# EAGLE design inverter_control (EAGLE 4.16)
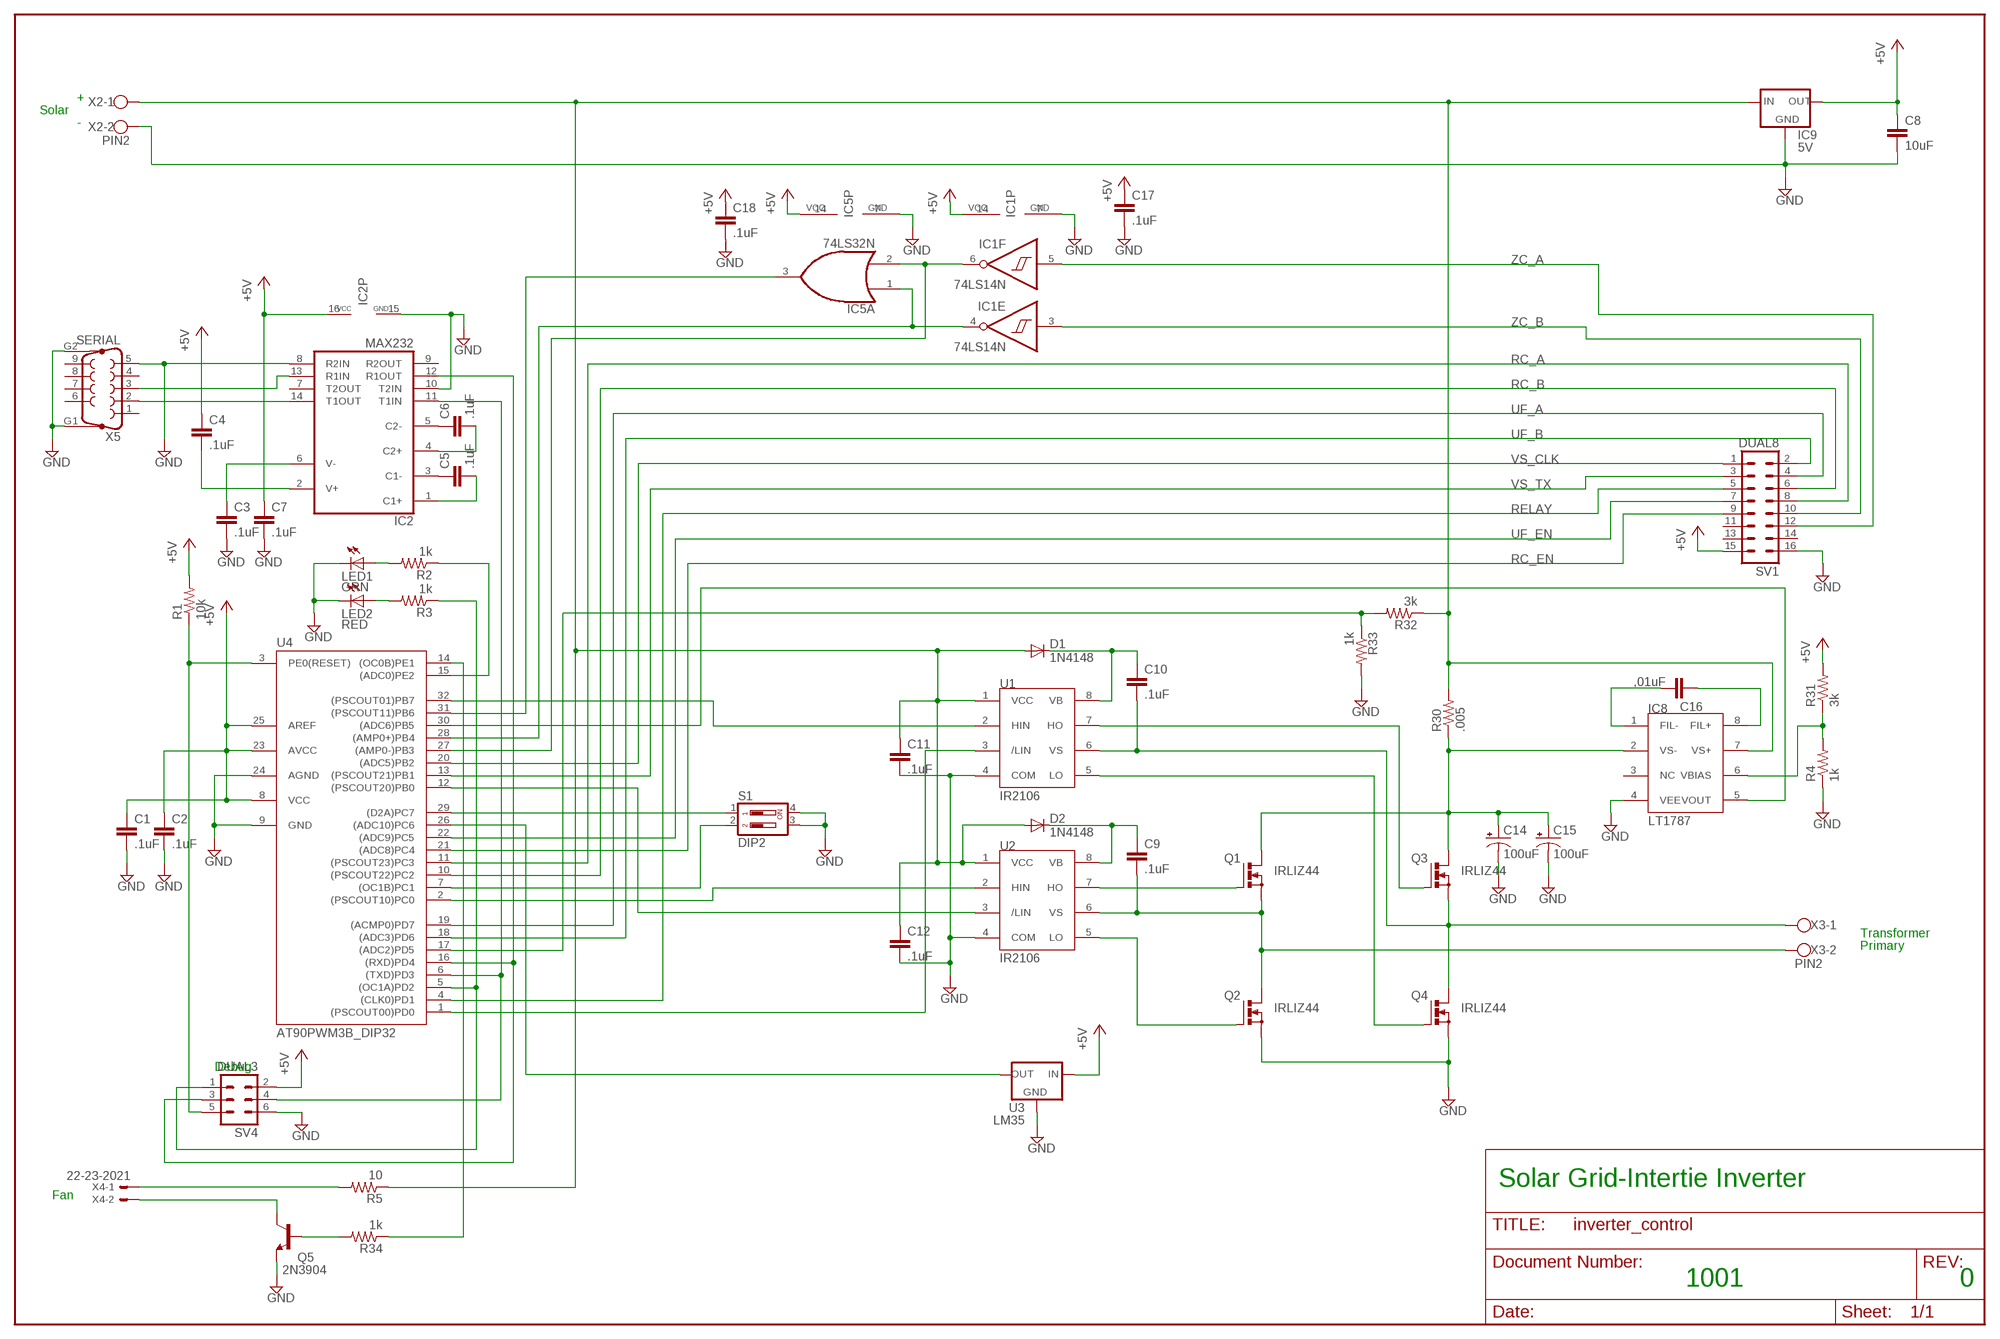
[diagram p0: schematic, sheet 1]

## Parts
C1  .1uF  C2,5-3  [C2.5-3]
C2  .1uF  C2,5-3  [C2.5-3]
C3  .1uF  C2,5-3  [C2.5-3]
C4  .1uF  C2,5-3  [C2.5-3]
C5  .1uF  C2,5-3  [C2.5-3]
C6  .1uF  C2,5-3  [C2.5-3]
C7  .1uF  C2,5-3  [C2.5-3]
C8  10uF  C5/3.5  [C5B3.5]
C9  .1uF  C2,5-3  [C2.5-3]
C10  .1uF  C2,5-3  [C2.5-3]
C11  .1uF  C2,5-3  [C2.5-3]
C12  .1uF  C2,5-3  [C2.5-3]
C14  100uF  CPOL-USE5-13  [E5-13]
C15  100uF  CPOL-USE5-13  [E5-13]
C16  ,01uF  C2,5-3  [C2.5-3]
C17  .1uF  C2,5-3  [C2.5-3]
C18  .1uF  C2,5-3  [C2.5-3]
D1  1N4148  [DO35-10]
D2  1N4148  [DO35-10]
IC1  74LS14N  [DIL14]
IC2  MAX232  [DIL16]
IC5  74LS32N  [DIL14]
IC8  LT1787  [SO08]
IC9  5V  78XXS  [78XXS]
LED1  GRN  LED3MM  [LED3MM]
LED2  RED  LED3MM  [LED3MM]
Q1  IRLIZ44  PMOSFET_NTO220BV  [TO220BV]
Q2  IRLIZ44  PMOSFET_NTO220BV  [TO220BV]
Q3  IRLIZ44  PMOSFET_NTO220BV  [TO220BV]
Q4  IRLIZ44  PMOSFET_NTO220BV  [TO220BV]
Q5  2N3904  [TO92]
R1  10k  R-US_0207/10  [0207/10]
R2  1k  R-US_0207/10  [0207/10]
R3  1k  R-US_0207/10  [0207/10]
R4  1k  R-US_0207/10  [0207/10]
R5  10  R-US_0207/10  [0207/10]
R30  .005  R-US_0207/12  [0207/12]
R31  3k  R-US_0207/10  [0207/10]
R32  3k  R-US_0207/10  [0207/10]
R33  1k  R-US_0207/10  [0207/10]
R34  1k  R-US_0207/10  [0207/10]
S1  DIP2  SD4-02  [SD4-02]
SV1  DUAL8  MA08-2  [MA08-2]
SV4  DUAL3  MA03-2  [MA03-2]
U1  IR2106  IR2103  [DIL08]
U2  IR2106  IR2103  [DIL08]
U3  LM35  [TO220S]
U4  AT90PWM3B_DIP32  [DIL32]
X2  PIN2  W237-02P  [W237-132]
X3  PIN2  W237-02P  [W237-132]
X4  22-23-2021  [22-23-2021]
X5  SERIAL  F09HP  [F09HP]

## Nets
+5V: C1.1 C2.1 C4.1 C7.1 C8.1 C17.1 C18.1 IC1.14(P:VCC) IC2.16(VCC) IC5.14(P:VCC) IC9.OUT R1.2 R31.2 SV1.15 SV4.2 U3.1(IN) U4.8(VCC) U4.23(AVCC) U4.25(AREF)
+VSOL: C11.1 C12.1 D1.A D2.A IC8.7(VS+) IC9.IN R5.1 R30.2 R32.1 U1.1(VCC) U2.1(VCC) X2.1
FIL+: C16.2 IC8.8(FIL+)
FIL-: C16.1 IC8.1(FIL-)
GND: C1.2 C2.2 C3.2 C7.2 C8.2 C11.2 C12.2 C14.- C15.- C17.2 C18.2 IC1.7(P:GND) IC2.8(R2IN) IC2.10(T2IN) IC2.15(GND) IC5.7(P:GND) IC8.4(VEE) IC9.GND LED1.K(C) LED2.K(C) Q2.S Q4.S Q5.3(E) R4.1 R33.2 S1.3 S1.4 SV1.16 SV4.6 U1.4(COM) U2.4(COM) U3.2(GND) U4.9(GND) U4.24(AGND) X2.2 X5.5 X5.G1 X5.G2
N$1: R34.1 U4.14((OC0B)PE1)
N$2: R2.1 U4.15((ADC0)PE2)
N$3: C3.1 IC2.6(V-)
N$4: C4.2 IC2.2(V+)
N$5: C6.1 IC2.5(C2-)
N$6: R1.1 SV4.5 U4.3(PE0(RESET))
N$7: C6.2 IC2.4(C2+)
N$8: R32.2 R33.1 U4.17((ADC2)PD5)
N$9: R5.2 X4.1
N$10: U1.3(/LIN) U4.1((PSCOUT00)PD0)
N$11: U1.2(HIN) U4.32((PSCOUT01)PB7)
N$12: IC2.14(T1OUT) X5.2
N$13: IC2.13(R1IN) X5.3
N$14: C5.1 IC2.3(C1-)
N$15: C5.2 IC2.1(C1+)
N$16: U3.3(OUT) U4.26((ADC10)PC6)
N$17: IC2.11(T1IN) SV4.4 U4.6((TXD)PD3)
N$18: IC2.12(R1OUT) SV4.3 U4.16((RXD)PD4)
N$19: LED1.A R2.2
N$20: LED2.A R3.2
N$21: U2.3(/LIN) U4.12((PSCOUT20)PB0)
N$23: Q5.1(C) X4.2
N$24: IC8.6(VBIAS) R4.2 R31.1
N$26: Q2.G U2.5(LO)
N$27: Q1.G U2.7(HO)
N$28: C9.2 Q1.S Q2.D U2.6(VS) X3.2
N$29: Q4.G U1.5(LO)
N$30: C10.2 Q3.S Q4.D U1.6(VS) X3.1
N$32: Q3.G U1.7(HO)
N$35: IC8.5(VOUT) U4.30((ADC6)PB5)
N$41: Q5.2(B) R34.2
N$47: R3.1 SV4.1 U4.5((OC1A)PD2)
N$51: S1.2 U4.7((OC1B)PC1)
N$54: S1.1 U4.29((D2A)PC7)
N$63: U2.2(HIN) U4.2((PSCOUT10)PC0)
N$65: IC1.6(F:O) IC5.2(A:I1) U4.27((AMP0-)PB3)
N$66: IC1.4(E:O) IC5.1(A:I0) U4.28((AMP0+)PB4)
N$67: IC5.3(A:O) U4.31((PSCOUT11)PB6)
RC_A: SV1.8 U4.11((PSCOUT23)PC3)
RC_B: SV1.6 U4.10((PSCOUT22)PC2)
RC_EN: SV1.9 U4.21((ADC8)PC4)
RELAY: SV1.5 U4.4((CLK0)PD1)
UF_A: SV1.4 U4.19((ACMP0)PD7)
UF_B: SV1.2 U4.18((ADC3)PD6)
UF_EN: SV1.7 U4.22((ADC9)PC5)
VB: C9.1 C10.1 D1.C D2.C U1.8(VB) U2.8(VB)
VBRIDGE: C14.+ C15.+ IC8.2(VS-) Q1.D Q3.D R30.1
VS_CLK: SV1.1 U4.20((ADC5)PB2)
VS_TX: SV1.3 U4.13((PSCOUT21)PB1)
ZC_A: IC1.5(F:I) SV1.12
ZC_B: IC1.3(E:I) SV1.10
Unconnected: IC1.1(D:I) IC1.2(D:O) IC1.8(C:O) IC1.9(C:I) IC1.10(B:O) IC1.11(B:I) IC1.12(A:O) IC1.13(A:I) IC2.7(T2OUT) IC2.9(R2OUT) IC5.4(B:I0) IC5.5(B:I1) IC5.6(B:O) IC5.8(C:O) IC5.9(C:I0) IC5.10(C:I1) IC5.11(D:O) IC5.12(D:I0) IC5.13(D:I1) IC8.3(NC) SV1.11 SV1.13 SV1.14 X5.1 X5.4 X5.6 X5.7 X5.8 X5.9

## Notes on the sheet
- +
- Solar
- -
- Transformer
- Primary
- Debug
- Solar Grid-Intertie Inverter
- Fan
- 1001 | 0

## Library data of the parts
C1-C12 C16-C18 = capacitor-wima:C: CAPACITOR naming: grid - package width
C14 C15 = rcl:CPOL-US: POLARIZED CAPACITOR, American symbol
D1 D2 = diode:1N4148: DIODE high speed (Philips)
IC1 = 74xx-us:74*14: Hex schmitt trigger INVERTER
IC2 = maxim:MAX232: RS232 TRANSEIVER
IC5 = 74xx-us:74*32: Quad 2-input OR gate
IC8 = SolarFlasher:LT1787
IC9 = v-reg:78XXS: VOLTAGE REGULATOR
LED1 LED2 = led:LED: LED OSRAM: - CHIPLED LG R971, LG N971, LY N971, LG Q971, LY Q971, LO R971, LY R971 LH N974, LH R974 LS Q976, LO Q976, LY Q976 LO Q996 - Hyper CHIPLED LW Q18S LB Q993, LB Q99A, LB R99A - SideLED LS A670, LO A670, LY A670, LG A670, LP A670 LB A673, LV A673, LT A673, LW A673 LH A674 LY A675 LS A676, LA A676, LO A676, LY A676, LW A676 LS A679, LY A679, LG A679 - Hyper Micro SIDELED® LS Y876, LA Y876, LO Y876, LY Y876 LT Y87S - SmartLED LW L88C, LW L88S LB L89C, LB L89S, LG L890 LS L89K, LO L89K, LY L89K LS L896, LA L896, LO L896, LY L896 - TOPLED LS T670, LO T670, LY T670, LG T670, LP T670 LSG T670, LSP T670, LSY T670, LOP T670, LYG T670 LG T671, LOG T671, LSG T671 LB T673, LV T673, LT T673, LW T673 LH T674 LS T676, LA T676, LO T676, LY T676, LB T676, LH T676, LSB T676, LW T676 LB T67C, LV T67C, LT T67C, LS T67K, LO T67K, LY T67K, LW E67C LS E67B, LA E67B, LO E67B, LY E67B, LB E67C, LV E67C, LT E67C LW T67C LS T679, LY T679, LG T679 LS T770, LO T770, LY T770, LG T770, LP T770 LB T773, LV T773, LT T773, LW T773 LH T774 LS E675, LA E675, LY E675, LS T675 LS T776, LA T776, LO T776, LY T776, LB T776 LHGB T686 LT T68C, LB T68C - Hyper Mini TOPLED® LB M676 - Mini TOPLED Santana® LG M470 LS M47K, LO M47K, LY M47K Source: http://www.osram.convergy.de/
Q1-Q4 = transistor-power:PMOSFET_N: Power MOSFET N-Channel
Q5 = transistor-npn:2N3904: NPN Transistor
R1-R5 R30-R34 = rcl:R-US_: RESISTOR, American symbol
S1 = switch-dil:SD4-02: DIL/CODE SWITCH
SV1 = con-lstb:MA08-2: PIN HEADER
SV4 = con-lstb:MA03-2: PIN HEADER
U1 U2 = irf-2:IR2103: High and low side driver
U3 = inverter:LM35
U4 = inverter:AT90PWM3B_DIP32
X2 X3 = con-wago-508:W237-02P: WAGO SREW CLAMP
X4 = con-molex:22-23-2021: .100" (2.54mm) Center Header - 2 Pin
X5 = inverter:F09HP: SUB-D

## Board
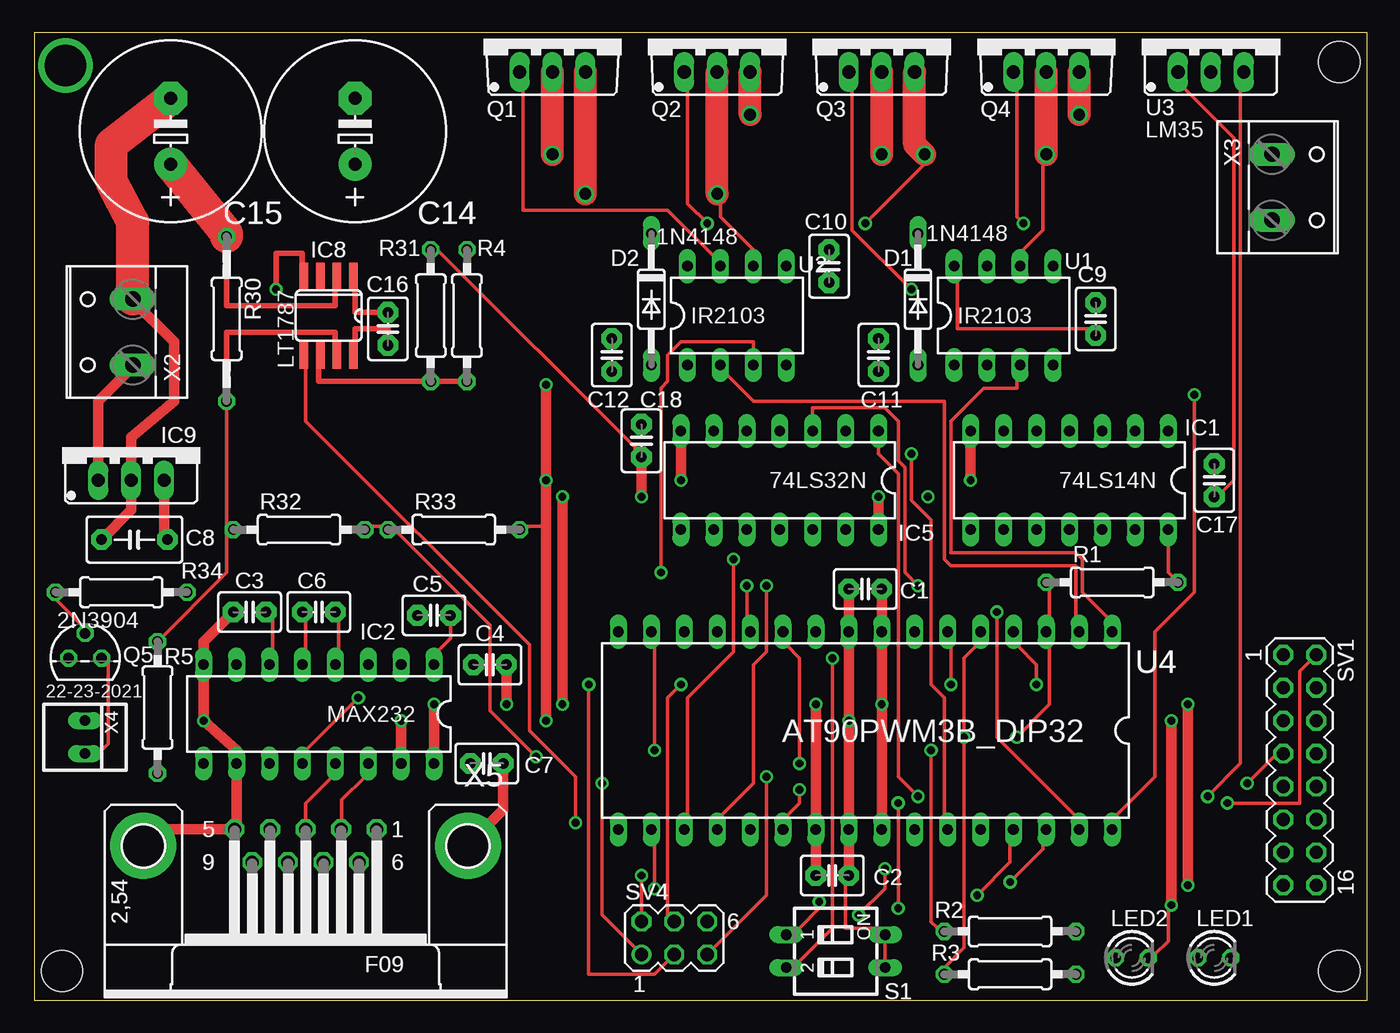
[diagram p1: board, top side]
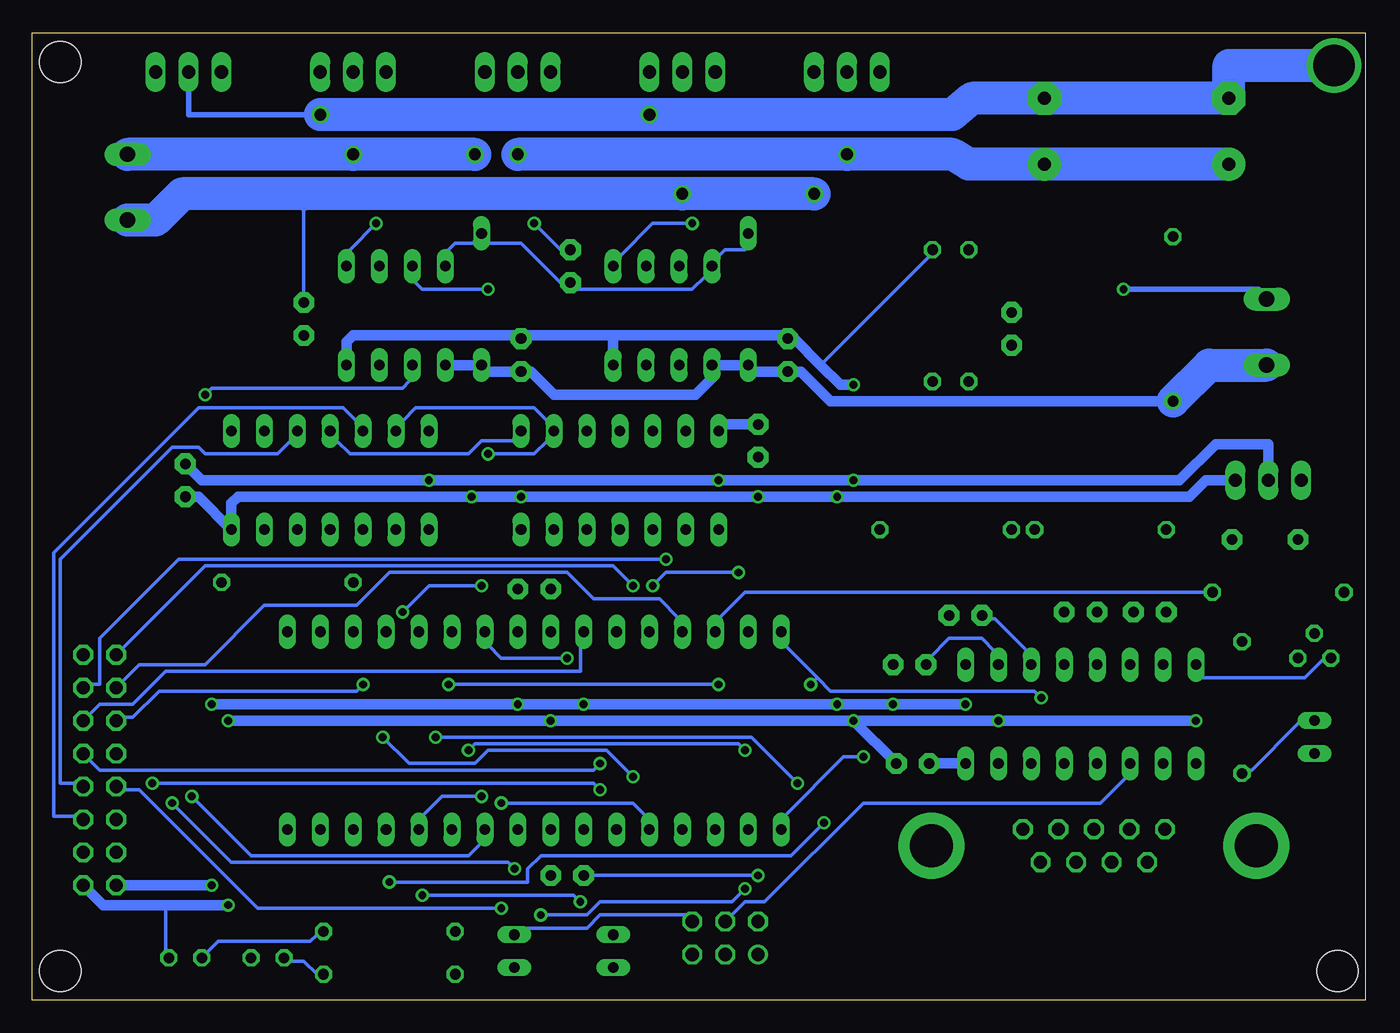
[diagram p2: board, bottom side, seen from below]

Size 102.85 x 74.6 mm. Coordinates in mm from the lower left corner, seen from the top.
Outline: 0,0 102.85,0 102.85,74.6 0,74.6 0,0
Copper layers (1*16): Top 0.035mm / dielectric 1.5mm / Bottom 0.035mm
Design rules "default": minimum track width 10mil, minimum drill 23mil, track to track 10mil, track to pad 10mil, pad to pad 10mil, via to via 10mil, smd to smd 10mil, copper to edge 10mil, drill to drill 10mil, minimum pad ring 10mil, minimum via ring 8mil, stop-mask expansion 4mil, vias tented up to drill 0mil, thermal gap 10mil
Holes 3.2 mm at 2.15,2.25 100.71,2.25 100.71,72.35

### Footprints (pad centres in the part's own frame; a part is rotated, then mirrored left to right if it is on the bottom)
C2.5-3 = drill 0.813 pad 1.6 octagon: 1 -1.27,0; 2 1.27,0
C5B3.5 = drill 0.813 pad 1.6 octagon: 1 -2.54,0; 2 2.54,0
E5-13 = drill 1.016 pad 2.54 round: + -2.54,0 | drill 1.016 pad 2.54 octagon: - 2.54,0
DO35-10 = drill 0.813 long: A 5.08,0; C -5.08,0
DIL14 = drill 0.813 long: 1 -7.62,-3.81; 2 -5.08,-3.81; 3 -2.54,-3.81; 4 0,-3.81; 5 2.54,-3.81; 6 5.08,-3.81; 7 7.62,-3.81; 8 7.62,3.81; 9 5.08,3.81; 10 2.54,3.81; 11 0,3.81; 12 -2.54,3.81; 13 -5.08,3.81; 14 -7.62,3.81
DIL16 = drill 0.813 long: 1 -8.89,-3.81; 2 -6.35,-3.81; 3 -3.81,-3.81; 4 -1.27,-3.81; 5 1.27,-3.81; 6 3.81,-3.81; 7 6.35,-3.81; 8 8.89,-3.81; 9 8.89,3.81; 10 6.35,3.81; 11 3.81,3.81; 12 1.27,3.81; 13 -1.27,3.81; 14 -3.81,3.81; 15 -6.35,3.81; 16 -8.89,3.81
SO08 = smd 0.66 x 2.032: 1 -1.905,-3.073; 2 -0.635,-3.073; 3 0.635,-3.073; 4 1.905,-3.073; 5 1.905,3.073; 6 0.635,3.073; 7 -0.635,3.073; 8 -1.905,3.073
78XXS = drill 1.016 long: GND 0,-2.54; IN -2.54,-2.54; OUT 2.54,-2.54
LED3MM = drill 0.813 octagon: A -1.27,0; K 1.27,0
TO220BV = drill 1.016 long: D 0,-2.54; G -2.54,-2.54; S 2.54,-2.54
TO92 = drill 0.813 octagon: 1 1.27,0; 2 0,1.905; 3 -1.27,0
0207/10 = drill 0.813 octagon: 1 -5.08,0; 2 5.08,0
0207/12 = drill 0.813 octagon: 1 -6.35,0; 2 6.35,0
SD4-02 = drill 0.813 long: 1 -1.27,-3.81; 2 1.27,-3.81; 3 1.27,3.81; 4 -1.27,3.81
MA08-2 = drill 1.016 octagon: 1 -8.89,-1.27; 2 -8.89,1.27; 3 -6.35,-1.27; 4 -6.35,1.27; 5 -3.81,-1.27; 6 -3.81,1.27; 7 -1.27,-1.27; 8 -1.27,1.27; 9 1.27,-1.27; 10 1.27,1.27; 11 3.81,-1.27; 12 3.81,1.27; 13 6.35,-1.27; 14 6.35,1.27; 15 8.89,-1.27; 16 8.89,1.27
MA03-2 = drill 1.016 round: 1 -2.54,-1.27 | drill 1.016 octagon: 2 -2.54,1.27; 3 0,-1.27; 4 0,1.27; 5 2.54,-1.27; 6 2.54,1.27
DIL08 = drill 0.813 long: 1 -3.81,-3.81; 2 -1.27,-3.81; 3 1.27,-3.81; 4 3.81,-3.81; 5 3.81,3.81; 6 1.27,3.81; 7 -1.27,3.81; 8 -3.81,3.81
TO220S = drill 1.016 long: 1 -2.54,-2.54; 2 0,-2.54; 3 2.54,-2.54
DIL32 = drill 0.813 long: 1 -19.05,-7.62; 2 -16.51,-7.62; 3 -13.97,-7.62; 4 -11.43,-7.62; 5 -8.89,-7.62; 6 -6.35,-7.62; 7 -3.81,-7.62; 8 -1.27,-7.62; 9 1.27,-7.62; 10 3.81,-7.62; 11 6.35,-7.62; 12 8.89,-7.62; 13 11.43,-7.62; 14 13.97,-7.62; 15 16.51,-7.62; 16 19.05,-7.62; 17 19.05,7.62; 18 16.51,7.62; 19 13.97,7.62; 20 11.43,7.62; 21 8.89,7.62; 22 6.35,7.62; 23 3.81,7.62; 24 1.27,7.62; 25 -1.27,7.62; 26 -3.81,7.62; 27 -6.35,7.62; 28 -8.89,7.62; 29 -11.43,7.62; 30 -13.97,7.62; 31 -16.51,7.62; 32 -19.05,7.62
W237-132 = drill 1.194 long: 1 -2.54,-0.635; 2 2.54,-0.635
22-23-2021 = drill 0.813 long: 1 -1.27,0; 2 1.27,0
F09HP = drill 1.016 octagon: 1 -5.486,-1.27; 2 -2.743,-1.27; 3 0,-1.27; 4 2.743,-1.27; 5 5.486,-1.27; 6 -4.115,1.27; 7 -1.372,1.27; 8 1.372,1.27; 9 4.115,1.27 | drill 3.302 pad 5.08 round: G1 -12.522,0; G2 12.522,0

### Placement (x,y rotation side)
C1  64.13,31.71 180 top
C2  61.59,9.61 0 top
C3  16.63,29.93 180 top
C4  35.17,25.87 180 top
C5  30.86,29.68 0 top
C6  21.97,29.93 0 top
C7  34.92,18.25 0 top
C8  7.74,35.52 180 top
C9  81.91,52.54 90 top
C10  61.34,56.6 90 top
C11  65.15,49.75 90 top
C12  44.57,49.75 90 top
C14  24.76,67.02 90 top
C15  10.54,67.02 90 top
C16  27.3,51.78 270 top
C17  91.05,40.09 90 top
C18  46.86,43.14 90 top
D1  68.19,54.06 270 top
D2  47.62,54.06 270 top
IC1  79.88,40.09 180 top
IC2  21.97,22.06 180 top
IC5  57.53,40.09 180 top
IC8  22.73,52.79 180 top
IC9  7.49,42.63 0 top
LED1  91.05,3.26 0 top
LED2  84.7,3.26 0 top
Q1  40,74.13 0 top
Q2  52.7,74.13 0 top
Q3  65.4,74.13 0 top
Q4  78.1,74.13 0 top
Q5  3.93,26.38 0 top
R1  83.18,32.22 0 top
R2  75.31,5.3 0 top
R3  75.31,1.99 0 top
R4  33.4,52.79 270 top
R5  9.52,22.57 270 top
R30  14.85,52.54 270 top
R31  30.6,52.79 90 top
R32  20.44,36.28 0 top
R33  32.38,36.28 0 top
R34  6.73,31.46 180 top
S1  61.84,3.77 270 top
SV1  97.66,17.74 270 top
SV4  49.4,4.79 0 top
U1  74.8,52.79 0 top
U2  54.22,52.79 0 top
U3  90.8,74.13 0 top
U4  64.13,20.79 180 top
X2  6.98,51.52 90 top
X3  96.13,62.7 270 top
X4  3.93,20.28 270 top
X5  20.95,11.9 180 top

### Tracks (layer width: path | path; a pad name or v marks a point on that pad's centre or on a via)
+5V  (via drill 0.6 pad 0.81, 0.61)
  Top 0.254: R31.2 31.11,57.87 46.35,42.63 46.35,42.13 C18.1 | R1.2 87.5,32.98 IC1.14 | v46.86,9.61 SV4.2 | U3.1 88.51,70.57 92.58,66.51 92.58,40.09 91.56,39.08 C17.1
  Top 0.813: IC9.OUT 10.03,35.78 C8.1 | v89.02,22.82 v89.02,8.85 | v40.76,38.82 v40.76,22.82 | U4.25 v65.4,22.82 U4.8 C1.1 | C2.1 U4.23 v60.32,22.82 | v65.15,38.82 IC5.14 | v46.86,38.82 C18.1 | v30.86,22.82 IC2.16 | v36.44,22.82 C4.1
  Bottom 0.254: C2.1 v46.86,9.61
  Bottom 0.813: IC9.OUT 12.31,40.09 13.58,38.82 v40.76,38.82 v46.86,38.82 v65.15,38.82 v68.96,38.82 86.99,38.82 87.5,38.32 IC1.14 90.04,38.82 C17.1 | v89.02,8.85 SV1.15 | v89.02,22.82 v65.4,22.82 v60.32,22.82 v40.76,22.82 v36.44,22.82 v30.86,22.82 | IC2.16 C7.1
+VSOL
  Top 0.254: R5.1 14.85,32.98 14.85,36.03 R32.1 14.85,36.54 R30.2
  Top 0.406: IC8.7 23.24,49.72 23.24,51.52 14.85,51.52 R30.2
  Top 0.813: X2.1 7.62,48.86 4.95,46.19 IC9.IN
  Bottom 0.813: R30.2 41.27,46.19 43.56,48.48 C12.1 47.11,48.48 D2.A U2.1 50.41,47.97 51.68,46.7 62.61,46.7 64.38,48.48 C11.1 67.69,48.48 D1.A U1.1
  Bottom 2.54: X2.1 12.06,48.98 R30.2
FIL+
  Top 0.406: IC8.8 24.76,49.72 24.76,51.78 27.3,51.78 C16.2
FIL-
  Top 0.406: IC8.1 24.76,55.87 24.76,53.05 C16.1
GND  (via drill 0.6, 0.6 pad 0.81, 0.9 pad 0.81, 3.2)
  Top 0.254: S1.3 S1.4 64.64,5.55 62.61,5.55 62.61,9.11 C2.2 | R33.2 37.71,36.54 39.49,36.54 | LED2.K 86.48,3.52 87.5,4.53 87.5,7.07 v87.75,7.33
  Top 0.406: IC8.4 20.7,55.87 20.7,57.62 18.66,57.62 v18.66,54.83
  Top 0.813: X2.2 7.49,54.06 10.79,50.76 10.79,46.19 7.49,43.4 IC9.GND 7.49,37.81 C8.2 | v72.26,40.09 IC1.7 | v49.91,40.09 IC5.7 | v87.75,21.55 v87.75,7.33 | v39.49,21.55 39.49,36.54 v39.49,40.09 v39.49,47.46 | C2.2 U4.24 v62.86,21.55 U4.9 C1.2 | C3.2 13.08,27.65 IC2.8 v13.08,21.55 15.62,19.27 IC2.10 15.62,13.17 X5.5 9.77,13.17 8.5,11.9 X5.G2 | v28.32,21.55 IC2.15 | C7.2 36.19,14.69 33.4,11.9 X5.G1
  Top 1.778: v55.24,68.29 Q2.S | v80.64,68.29 Q4.S
  Top 2.54: X2.2 7.62,60.03 5.96,63.21 5.96,66 C15.-
  Bottom 0.254: SV4.6 52.45,6.57 59.05,6.57 60.07,5.55 64.64,5.55 S1.4 | Q5.3 3.17,26.38 4.69,24.85 12.82,24.85 IC2.8 | R4.1 33.65,57.37 42.03,48.98 | LED1.K 92.58,3.52 92.58,7.33
  Bottom 0.406: U3.2 90.8,68.29 v80.64,68.29 | X2.2 7.49,54.06 8.25,54.83 v18.66,54.83
  Bottom 0.813: IC9.GND 7.49,42.89 11.55,42.89 14.35,40.09 v39.49,40.09 v49.91,40.09 v72.26,40.09 89.78,40.09 C17.2 | SV1.16 97.4,7.33 92.58,7.33 v87.75,7.33 | v39.49,21.55 v62.86,21.55 v87.75,21.55 | 49.91,44.41 IC5.7 49.4,44.41 C18.2 | U1.4 78.61,50.76 78.1,51.27 65.15,51.27 64.89,51.02 | 64.89,51.02 C11.2 | 58.03,51.27 44.83,51.27 C12.2 44.06,51.02 42.03,48.98 40.51,47.46 v39.49,47.46 | 58.03,51.27 64.89,51.27 64.89,51.02 | 58.03,51.27 U2.4 | v13.08,21.55 v28.32,21.55 v39.49,21.55 | v39.49,21.55 C7.2
  Bottom 2.54: v80.64,68.29 v55.24,68.29 31.87,68.29 30.35,69.56 C14.- C15.- 10.54,72.1 v2.41,72.1
N$1
  Bottom 0.254: R34.1 47.87,31.46 49.91,29.43 U4.14
N$2  (via drill 0.61)
  Top 0.254: v69.21,19.27 69.21,6.06 69.72,5.55 R2.1 | v47.87,19.27 47.87,27.39 U4.15
  Bottom 0.254: v69.21,19.27 68.7,19.77 48.38,19.77 v47.87,19.27
N$3
  Top 0.254: IC2.6 18.41,26.89 18.41,29.43 C3.1
N$4
  Bottom 0.254: IC2.2 28.57,26.89 29.59,27.9 32.13,27.9 33.65,26.38 C4.2
N$5
  Top 0.254: IC2.5 20.95,26.89 20.95,29.43 C6.1
N$6  (via drill 0.61)
  Top 0.254: R1.1 78.35,31.97 78.35,29.43 U4.3 78.35,27.39 78.35,22.82 v75.81,20.28 | v56.51,17.23 56.51,8.09 SV4.5
  Bottom 0.254: v56.51,17.23 58.54,19.27 67.69,19.27 68.7,18.25 73.78,18.25 v75.81,20.28
N$7
  Top 0.254: IC2.4 23.49,26.89 23.49,29.43 C6.2
N$8  (via drill 0.61)
  Top 0.254: R32.2 26.03,36.54 27.05,36.54 R33.1 27.55,36.54 35.17,28.92 35.17,22.31 v38.73,18.76
  Bottom 0.254: v38.73,18.76 40.25,18.76 44.83,14.19 U4.17
N$9
  Bottom 0.254: X4.1 5.2,21.3 8.76,17.74 9.27,17.74 R5.2
N$10
  Top 0.254: U4.1 82.93,29.43 80.89,31.46 80.89,34 80.39,34.51 70.73,34.51 70.73,44.67 73.27,47.21 75.81,47.21 75.81,47.71 U1.3
N$11  (via drill 0.61)
  Top 0.254: v89.53,46.7 89.53,31.46 86.48,28.41 86.48,17.23 83.43,14.19 U4.32
  Bottom 0.254: v89.53,46.7 89.02,47.21 74.29,47.21 73.78,47.71 U1.2
N$12
  Top 0.254: IC2.14 25.52,17.23 23.74,15.46 23.74,13.17 X5.2
N$13
  Top 0.254: IC2.13 22.98,17.23 20.95,15.2 X5.3
N$14
  Bottom 0.254: IC2.3 26.03,26.89 28.57,29.43 29.08,29.43 C5.1
N$15
  Top 0.254: IC2.1 31.11,26.89 32.13,27.9 C5.2
N$16  (via drill 0.61)
  Top 0.254: v90.55,15.71 93.09,18.25 93.09,70.57 U3.3
  Bottom 0.254: v90.55,15.71 85.97,11.14 69.21,11.14 68.19,12.15 U4.26
N$17  (via drill 0.61)
  Top 0.254: v70.73,24.35 70.73,27.39 U4.6 | v49.91,24.35 48.89,23.33 48.89,6.57 SV4.4
  Bottom 0.254: IC2.11 18.41,17.23 20.44,15.2 38.73,15.2 46.35,7.58 47.87,7.58 SV4.4 | v49.91,24.35 v70.73,24.35
N$18  (via drill 0.61)
  Top 0.254: v25.01,23.33 20.95,19.27 IC2.12 | v42.79,24.35 42.79,1.99 47.87,1.99 SV4.3
  Bottom 0.254: v25.01,23.33 25.52,23.84 41.27,23.84 42.29,24.85 | 42.29,24.85 44.83,27.39 U4.16 | 42.29,24.85 v42.79,24.35
N$19
  Bottom 0.254: R2.2 80.89,5.04 81.4,4.53 88.51,4.53 LED1.A
N$20
  Bottom 0.254: R3.2 80.89,1.99 81.91,3.01 82.93,3.01 LED2.A
N$21  (via drill 0.61)
  Top 0.254: v54.99,31.97 54.99,29.43 U4.12 | v48.38,32.98 48.38,47.21 48.89,47.71 48.89,49.75 49.91,50.76 55.49,50.76 U2.3
  Bottom 0.254: v54.99,31.97 53.97,32.98 v48.38,32.98
N$23
  Top 0.254: X4.2 5.2,19.27 5.71,19.77 5.71,26.38 Q5.1
N$24
  Top 0.406: IC8.6 21.97,49.72 21.97,47.71 R31.1 R4.2
N$26  (via drill 0.61)
  Top 0.254: v51.94,59.91 50.41,61.43 50.41,70.57 Q2.G
  Bottom 0.254: v51.94,59.91 54.99,59.91 57.53,57.37 U2.5
N$27
  Top 0.254: U2.7 52.45,57.37 48.89,60.92 37.71,60.92 37.71,70.57 Q1.G
N$28  (via drill 0.9 pad 0.81)
  Top 0.254: U2.6 55.49,57.87 52.95,60.41 52.95,61.43 v52.7,62.19
  Top 1.778: v42.54,62.19 Q1.S | v52.7,62.19 Q2.D
  Bottom 0.254: 81.91,62.19 C9.2
  Bottom 2.54: X3.2 93.34,60.16 91.31,62.19 81.91,62.19 v52.7,62.19 v42.54,62.19
N$29  (via drill 0.61)
  Top 0.254: v76.32,59.91 75.81,60.41 75.81,70.57 Q4.G
  Bottom 0.254: v76.32,59.91 78.35,57.87 U1.5
N$30  (via drill 0.61, 0.9 pad 0.81)
  Top 0.254: U1.6 76.32,57.87 77.85,59.4 77.85,64.48 v78.1,65.24 | v64.13,59.91 68.7,64.48 v68.7,65.24
  Top 1.778: Q3.S 67.94,66 v68.7,65.24 | v78.1,65.24 Q4.D
  Bottom 0.254: v64.13,59.91 62.1,57.87 C10.2
  Bottom 2.54: v68.7,65.24 v78.1,65.24 X3.1
N$32  (via drill 0.61)
  Top 0.254: v67.69,54.83 63.11,59.4 63.11,70.57 Q3.G
  Bottom 0.254: v67.69,54.83 72.77,54.83 73.27,55.33 U1.7
N$35  (via drill 0.61)
  Top 0.254: v41.78,13.68 41.78,17.23 38.22,20.79 38.22,27.39 20.95,44.67 20.95,48.73 IC8.5 | v75.31,9.11 77.85,11.65 77.85,12.15 U4.30
  Bottom 0.254: v41.78,13.68 44.32,11.14 63.62,11.14 64.64,10.12 64.64,9.11 v75.31,9.11
N$41
  Top 0.254: Q5.2 3.68,28.92 1.65,30.95 R34.2
N$47  (via drill 0.61)
  Top 0.254: R3.1 70.23,2.5 71.75,4.03 v71.75,20.28 71.75,26.38 72.77,27.39 U4.5 | v43.81,16.73 43.81,6.57 SV4.1
  Bottom 0.254: v43.81,16.73 47.37,20.28 v71.75,20.28
N$51  (via drill 0.61)
  Top 0.254: v61.59,26.38 61.59,5.55 59.05,3.01 S1.2
  Bottom 0.254: v61.59,26.38 66.67,26.38 67.69,27.39 U4.7
N$54  (via drill 0.61)
  Top 0.254: v60.57,7.58 60.57,7.07 59.05,5.55 S1.1 | v72.77,8.09 75.31,10.63 75.31,12.15 U4.29
  Bottom 0.254: v60.57,7.58 61.08,8.09 v72.77,8.09
N$63
  Top 0.254: U2.2 53.46,48.22 55.49,46.19 70.23,46.19 70.23,34 70.73,33.49 80.39,33.49 80.39,29.43 U4.2
N$65  (via drill 0.61)
  Top 0.254: v67.69,42.13 67.69,38.57 69.21,37.05 69.21,24.35 70.23,23.33 70.23,14.19 U4.27
  Bottom 0.254: v67.69,42.13 64.13,42.13 63.11,43.14 IC5.2 63.11,44.67 64.13,45.68 73.27,45.68 74.29,44.67 IC1.6
N$66  (via drill 0.61)
  Top 0.254: v68.19,15.71 66.67,17.23 66.67,40.6 65.15,42.13 IC5.1
  Bottom 0.254: v68.19,15.71 71.24,15.71 72.77,14.19 U4.28 | IC1.4 79.37,43.14 78.35,42.13 69.21,42.13 68.19,43.14 65.65,43.14 IC5.1
N$67  (via drill 0.61)
  Top 0.254: v74.29,29.93 74.29,20.28 80.39,14.19 U4.31 | v68.19,31.97 67.18,32.98 67.18,41.11 66.67,41.62 66.67,44.67 65.65,45.68 60.07,45.68 IC5.3
  Bottom 0.254: v74.29,29.93 72.26,31.97 v68.19,31.97
RC_A  (via drill 0.61)
  Top 0.254: v59.05,18.25 59.05,26.38 58.03,27.39 U4.11
  Bottom 0.254: v59.05,18.25 59.56,17.74 97.66,17.74 SV1.8
RC_B
  Bottom 0.254: U4.10 60.57,27.39 60.57,25.36 92.58,25.36 95.12,22.82 97.66,22.82 SV1.6
RC_EN  (via drill 0.61)
  Top 0.254: v66.67,15.2 v66.67,7.07
  Bottom 0.254: v66.67,15.2 56.51,15.2 55.49,14.19 U4.21 | v66.67,7.07 85.47,7.07 94.61,16.22 96.13,16.22 SV1.9
RELAY  (via drill 0.61)
  Top 0.254: v77.34,24.35 77.34,25.87 75.81,27.39 U4.4
  Bottom 0.254: v77.34,24.35 77.85,23.84 93.09,23.84 95.12,21.81 96.13,21.81 SV1.5
UF_A  (via drill 0.61)
  Top 0.254: v53.97,34 53.97,26.89 50.41,23.33 50.41,14.19 U4.19
  Bottom 0.254: v53.97,34 91.56,34 97.66,27.9 97.66,24.35 98.67,24.35 SV1.4
UF_B  (via drill 0.61)
  Top 0.254: v47.87,8.6 47.87,12.15 U4.18 | v63.62,6.57 65.65,8.6 v65.65,10.12 | v92.07,15.2 97.66,15.2 97.66,25.36 SV1.2
  Bottom 0.254: v47.87,8.6 48.89,7.58 59.05,7.58 60.07,6.57 v63.62,6.57 | v65.65,10.12 66.16,10.63 87.5,10.63 v92.07,15.2
UF_EN  (via drill 0.61)
  Top 0.254: v59.05,16.22 59.05,15.2 58.03,14.19 U4.22 | v93.59,16.73 96.13,19.27 SV1.7
  Bottom 0.254: v59.05,16.22 59.56,16.73 v93.59,16.73
VB
  Top 0.254: C9.1 81.4,51.78 71.24,51.78 71.24,55.33 U1.8
  Bottom 0.254: D2.C 47.87,57.87 49.4,57.87 49.91,57.37 U2.8 50.92,55.84 51.94,54.83 61.08,54.83 C10.1 62.1,55.33 65.15,58.38 67.69,58.38 D1.C 68.7,58.38 70.23,58.38 70.73,57.87 U1.8
VBRIDGE  (via drill 0.9 pad 0.81)
  Top 0.406: IC8.2 23.24,55.87 23.24,53.56 14.85,53.56 R30.1
  Top 1.778: v40,65.24 Q1.D | v65.4,65.24 Q3.D
  Top 2.54: R30.1 14.85,59.14 C15.+
  Bottom 2.54: C15.+ C14.+ 30.6,64.48 31.87,65.24 v40,65.24 v65.4,65.24
VS_CLK  (via drill 0.61)
  Top 0.254: v56.51,31.97 56.51,26.89 55.49,25.87 55.49,16.73 52.95,14.19 U4.20
  Bottom 0.254: v56.51,31.97 58.03,33.49 89.53,33.49 SV1.1
VS_TX
  Bottom 0.254: U4.13 52.95,29.43 54.48,30.95 59.56,30.95 61.59,32.98 75.31,32.98 77.85,30.44 84.96,30.44 89.53,25.87 94.61,25.87 SV1.3
ZC_A
  Bottom 0.254: IC1.5 77.85,44.67 78.86,45.68 90.04,45.68 101.21,34.51 101.21,14.19 99.18,14.19 SV1.12
ZC_B
  Bottom 0.254: IC1.3 82.93,43.14 83.94,42.13 89.53,42.13 90.04,42.63 92.07,42.63 100.71,34 100.71,16.73 99.18,16.73 SV1.10

### Text on the board
tDocu: Trans | Solar | + - | Inverter Rev. A | by Tim Nolan 2008 | Fan | Control
_tsilk: Q1 | Q2 | Q3 | Q4 | U3 | LM35 | X3 | C15 | C14 | C10 | R31 | 1N4148 | 1N4148 | IC8 | R4 | D2 | U1 | U2 | D1 | C9 | R30 | LT1787 | C16 | IR2103 | IR2103 | X2 | C12 | C18 | C11 | IC1 | IC9 | 74LS32N | 74LS14N | R32 | R33 | C8 | C17 | IC5 | R34 | C3 | R1 | C1 | C6 | C5 | 2N3904 | C4 | IC2 | 1 | SV1 | Q5 | R5 | U4 | 22-23-2021 | MAX232 | AT90PWM3B_DIP32 | X4 | X5 | C7 | 5 | 1 | 9 | 6 | 16 | 2,54 | C2 | SV4 | ON | R2 | 6 | 1 | LED2 | LED1 | F09 | R3 | 2 | 1 | S1